# Altium schematic sheet Connectors.SchDoc
size A; SheetNumber: 13
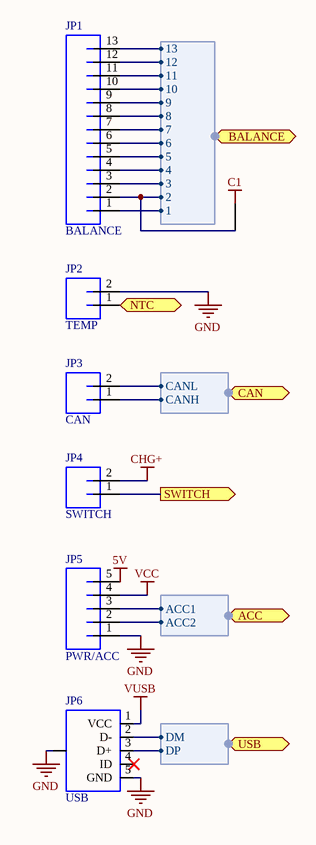
[diagram p0: Connectors.SchDoc]

## Parts
*1  NetTie  [NetTie]  (value not drawn)  (net tie, no BOM)
JP1  BALANCE  [JST-XH-13-PTH-VERT]
JP2  TEMP  [JST-PH-2-PTH-VERT]
JP3  CAN  [JST-PH-2-PTH-VERT]
JP4  SWITCH  [JST-PH-2-PTH-VERT]
JP5  PWR/ACC  [JST-PH-5-PTH-VERT]
JP6  USB  [USB-MICROB]

## Ports
ACC (harness Accessory Outputs), BALANCE (harness Balance), CAN (harness CAN Output), NTC (in), SWITCH (out), USB (harness USB)

## Harnesses
USB: DM, DP
Accessory Outputs: ACC1, ACC2
CAN Output: CANL, CANH
Balance: 13, 12, 11, 10, 9, 8, 6, 7, 5, 3, 4, 2, 1

## Nets
5V: JP5.5
C1: *1.2
CHG+: JP4.2
GND: JP2.2 JP5.1 JP6.5(GND) JP6.6(SHIELD)
VCC: JP5.4
VUSB: JP6.1(VCC)
NTC: JP2.1 ; port NTC
SWITCH: JP4.1 ; port SWITCH
Net*1_1: *1.1 JP1.2 ; port BALANCE.2
NetJP1_1: JP1.1 ; port BALANCE.1
NetJP1_3: JP1.3 ; port BALANCE.3
NetJP1_4: JP1.4 ; port BALANCE.4
NetJP1_5: JP1.5 ; port BALANCE.5
NetJP1_6: JP1.6 ; port BALANCE.6
NetJP1_7: JP1.7 ; port BALANCE.7
NetJP1_8: JP1.8 ; port BALANCE.8
NetJP1_9: JP1.9 ; port BALANCE.9
NetJP1_10: JP1.10 ; port BALANCE.10
NetJP1_11: JP1.11 ; port BALANCE.11
NetJP1_12: JP1.12 ; port BALANCE.12
NetJP1_13: JP1.13 ; port BALANCE.13
NetJP3_1: JP3.1 ; port CAN.CANH
NetJP3_2: JP3.2 ; port CAN.CANL
NetJP5_2: JP5.2 ; port ACC.ACC2
NetJP5_3: JP5.3 ; port ACC.ACC1
NetJP6_2: JP6.2(D-) ; port USB.DM
NetJP6_3: JP6.3(D+) ; port USB.DP

Not connected (* = marked no-connect by the designer): JP6 4(ID)*

## Library data of the parts
JP1 = JST_XH_13_VERT: Manufacturer: JST Sales America, Inc.; PartNumber: B13B-XH-A(LF)(SN); Mounting Technology: Through Hole; PackageReference: JST-XH
JP2-JP4 = JST_PH_2_VERT: Manufacturer: JST Sales America, Inc.; PartNumber: B2B-PH-K-S(LF)(SN); Mounting Technology: Through Hole; PackageReference: JST-PH
JP5 = JST_PH_5_VERT: Manufacturer: JST Sales America, Inc.; PartNumber: B5B-PH-K-S(LF)(SN); PackageReference: JST-PH; Mounting Technology: Through Hole
JP6 = USB_MICROB_SMT: pin to pad: 1>VBUS 2>D- 3>D+ 4>ID 5>GND 6>MT1+P$1+P$2+MT2; PartNumber: 10118192-0001LF; Manufacturer: Amphenol FCI; Mounting Technology: Surface Mount; PackageReference: USB - Micro B